# EAGLE schematic C-USG-CPU-10 (EAGLE 9.1.3)
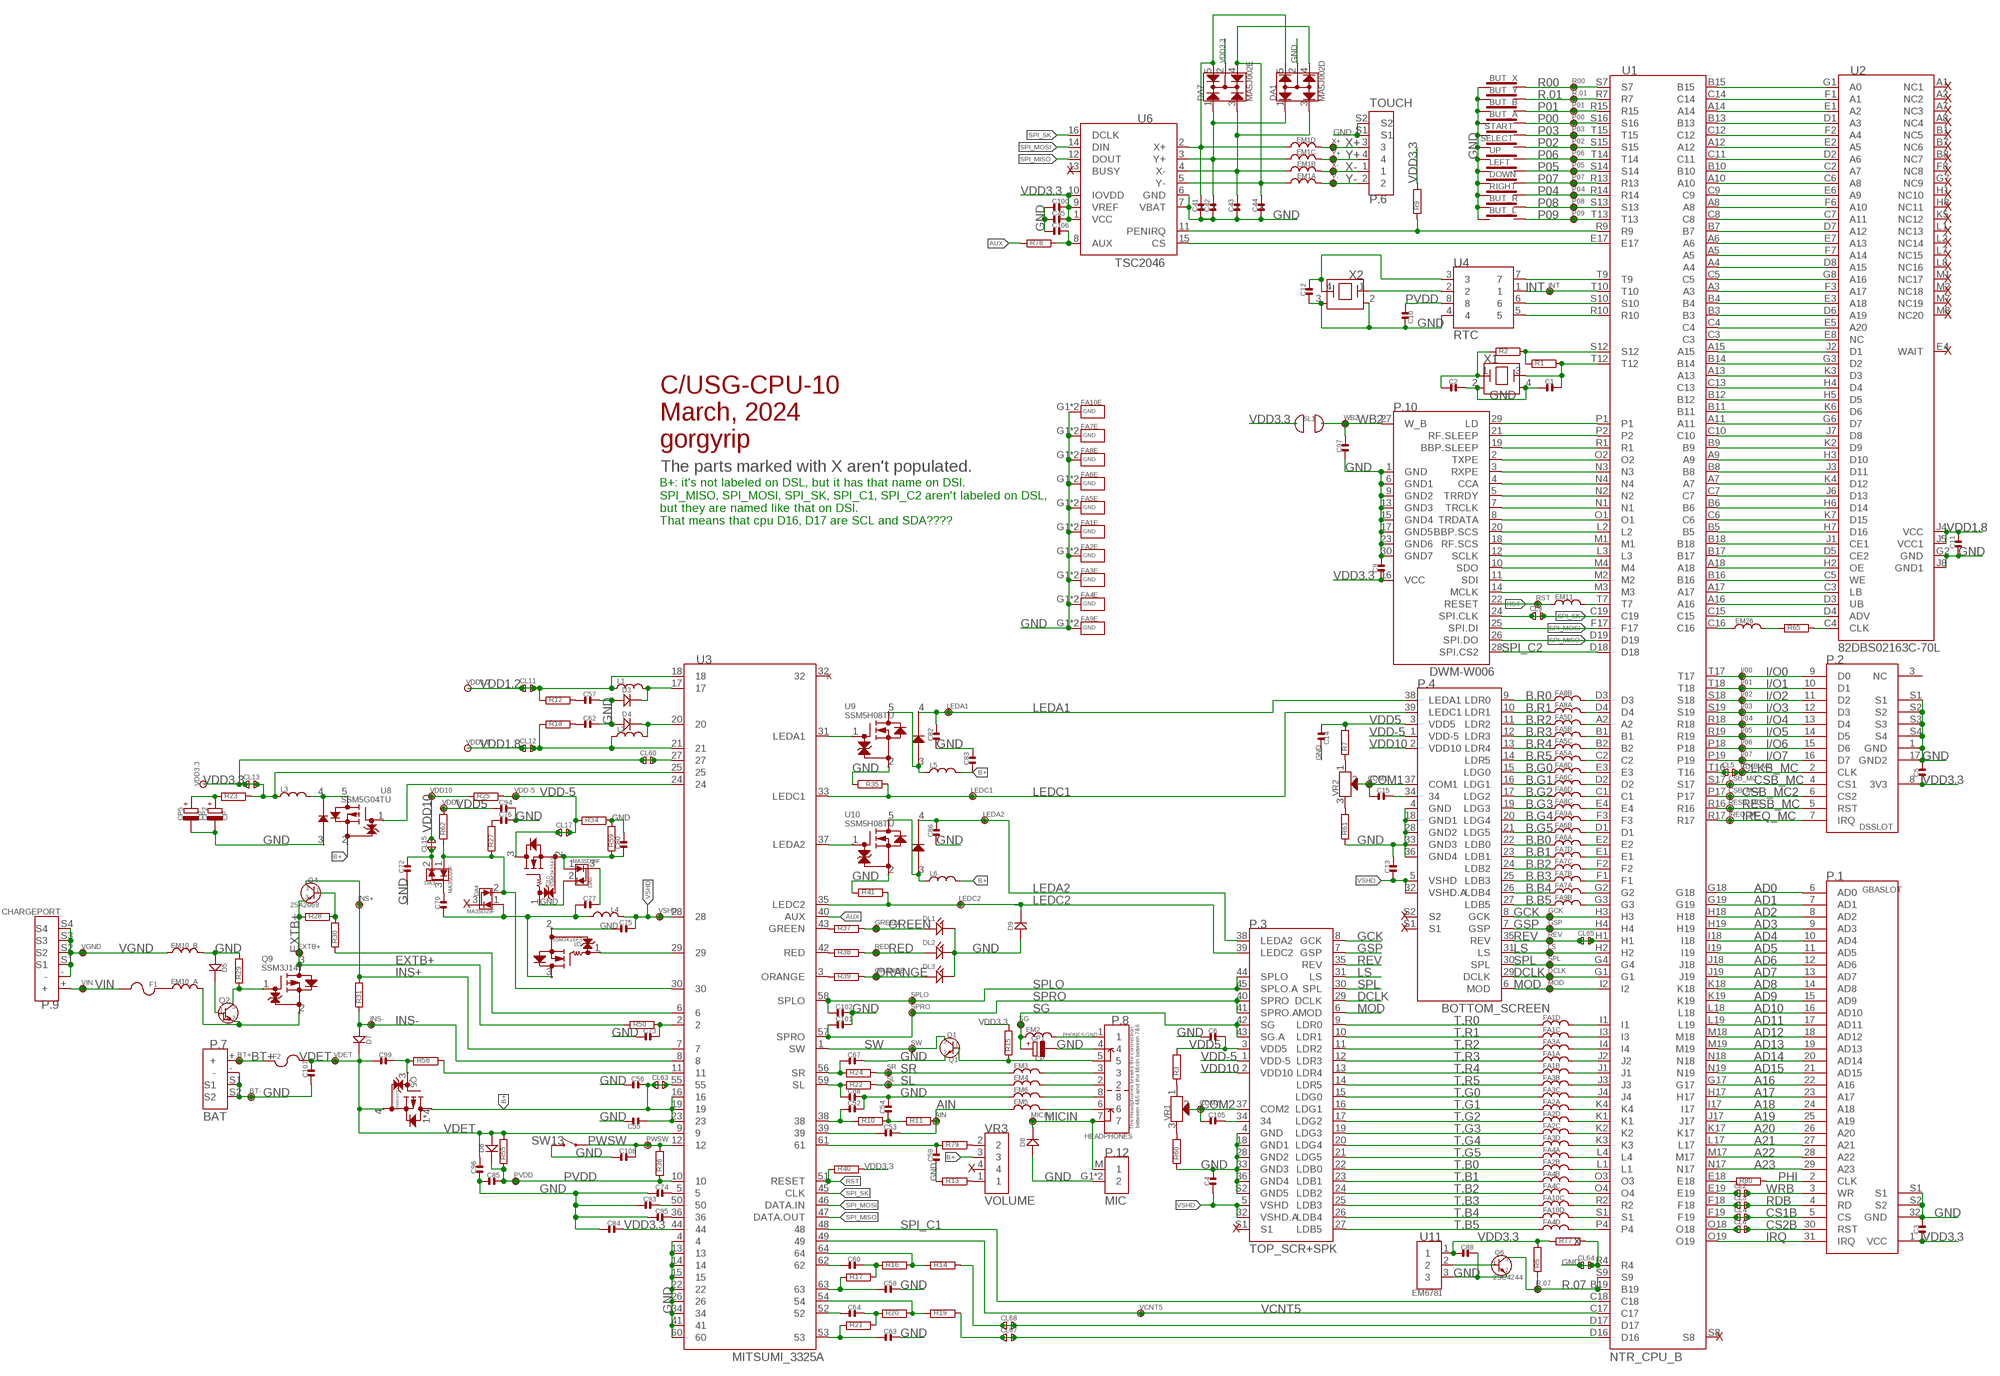
[diagram p0: schematic, sheet 1, part 1 of 2]
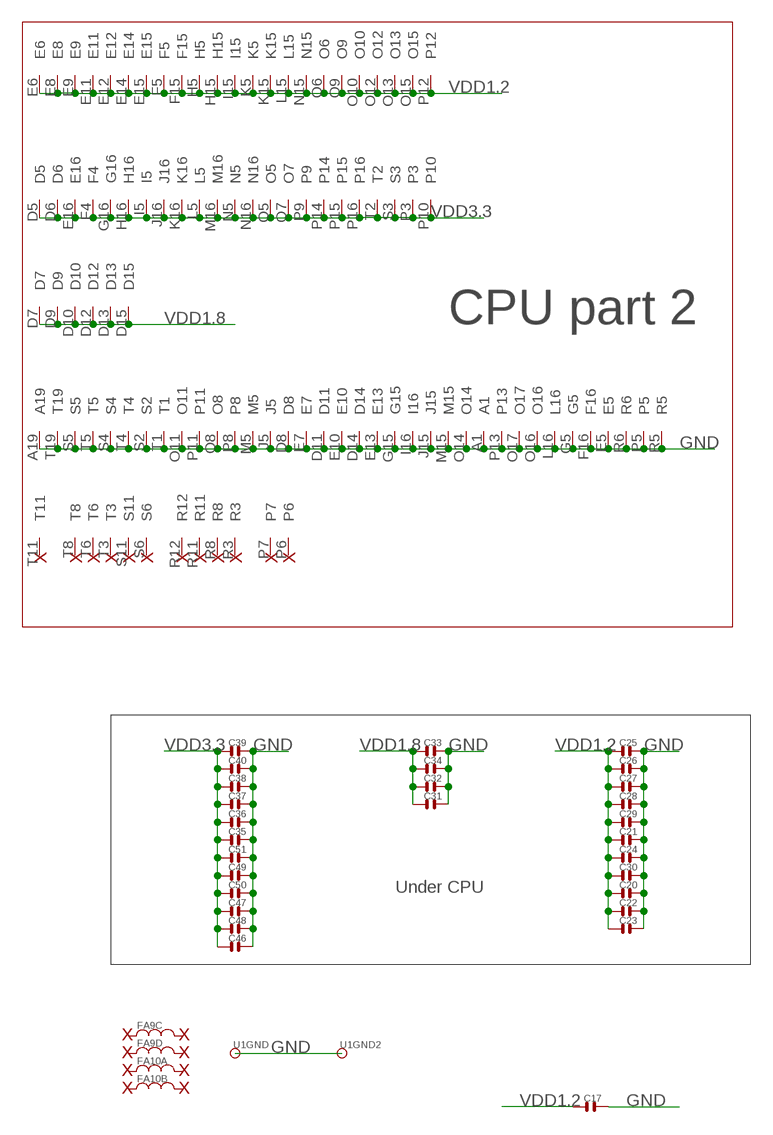
[diagram p1: schematic, sheet 1, part 2 of 2]

## Parts
AIN  TP  [TP]
BT+  TP  [TP]
BT-  TP  [TP]
BUT_A  BUT_ABXY  [BUTTONSABXY]
BUT_B  BUT_ABXY  [BUTTONSABXY]
BUT_L  SHOULDER_BUT  [SHOULDER_BUT]
BUT_R  SHOULDER_BUT  [SHOULDER_BUT]
BUT_X  BUT_ABXY  [BUTTONSABXY]
BUT_Y  BUT_ABXY  [BUTTONSABXY]
C1  C0402  [0402]
C2  C0402  [0402]
C3  C0402  [0402]
C4  C0402  [0402]
C5  C0402  [0402]
C6  C0402  [0402]
C9  C0805  [0805]
C10  C0402  [0402]
C11  C0402  [0402]
C12  C0402  [0402]
C13  C0402  [0402]
C14  C0402  [0402]
C15  C0805  [0805]
C17  C0402  [0402]
C20  C0201  [0201]
C21  C0201  [0201]
C22  C0201  [0201]
C23  C0201  [0201]
C24  C0201  [0201]
C25  C0201  [0201]
C26  C0201  [0201]
C27  C0201  [0201]
C28  C0201  [0201]
C29  C0201  [0201]
C30  C0201  [0201]
C31  C0201  [0201]
C32  C0201  [0201]
C33  C0201  [0201]
C34  C0201  [0201]
C35  C0201  [0201]
C36  C0201  [0201]
C37  C0201  [0201]
C38  C0201  [0201]
C39  C0201  [0201]
C40  C0201  [0201]
C41  C0402  [0402]
C42  C0402  [0402]
C43  C0402  [0402]
C44  C0402  [0402]
C45  C0402  [0402]
C46  C0201  [0201]
C47  C0201  [0201]
C48  C0201  [0201]
C49  C0201  [0201]
C50  C0201  [0201]
C51  C0201  [0201]
C52  C0402  [0402]
C53  C0402  [0402]
C54  C0805  [0805]
C55  C0805  [0805]
C56  C0402  [0402]
C57  C0805  [0805]
C58  C0402  [0402]
C59  C0402  [0402]
C60  C0402  [0402]
C62  C0805  [0805]
C63  C0402  [0402]
C64  C0402  [0402]
C67  C0402  [0402]
C68  C0402  [0402]
C70  C0402  [0402]
C72  C0805  [0805]
C73  C0603  [0603]
C74  C0402  [0402]
C75  C0402  [0402]
C76  C0805  [0805]
C77  C0402  [0402]
C80  C0603  [0603]
C82  C0805  [0805]
C83  C0805  [0805]
C84  C0402  [0402]
C85  C0603  [0603]
C86  C0805  [0805]
C88  C0402  [0402]
C93  C0402  [0402]
C94  C0805  [0805]
C95  C0603  [0603]
C96  C0402  [0402]
C97  C0402  [0402]
C99  C0402  [0402]
C100  C0402  [0402]
C101  C0402  [0402]
C102  C0402  [0402]
C105  C0805  [0805]
C106  C0402  [0402]
C107  C0402  [0402]
C108  C0402  [0402]
CL2  CL  [CL0402]
CL3  CL  [CL0402]
CL4  CL  [CL0402]
CL5  CL  [CL0402]
CL6  CL  [CL0402]
CL9  CL  [CL0402]
CL11  CL  [CL0402]
CL12  CL  [CL0402]
CL13  CL  [CL0402]
CL15  CL  [CL0402]
CL17  CL  [CL0402]
CL60  CL  [CL0402]
CL63  CL  [CL0402]
CL64  CL  [CL0402]
CL65  CL  [CL0402]
CL67  CL  [CL0402]
CL68  CL  [CL0402]
CLKB_MC  TP  [TP]
COM1  TP  [TP]
COM2  TP  [TP]
CP1  CP  [CP]
CP2  CP  [CP]
CP5  CP  [CP]
CSB_MC  TP  [TP]
CSB_MC2  TP  [TP]
D3  D3.4  [D3.4]
D4  D3.4  [D3.4]
D5  D5  [D5]
D6  D6  [D6]
D7  D7  [D7]
D8  D8  [D8]
D9  D5  [D5]
DA1  MA5J002D  [DA]
DA3  MA3SD29F  [MA3SD29F]
DA4  MA3SD29F  [MA3SD29F]
DA5  MA3SD29F  [MA3SD29F]
DA7  MA5J002E  [DA]
DCLK  TP  [TP]
DL1  DL  [DL]
DL2  DL  [DL]
DL3  DL  [DL]
DOWN  DPAD  [DPAD]
EM1  FILTER_NETWORK  [FILTER_NETWORK]
EM2  FILTER0603  [0603]
EM3  FILTER0603  [0603]
EM4  FILTER0603  [0603]
EM5  FILTER0603  [0603]
EM6  FILTER0603  [0603]
EM10  EM10  [EM10]
EM11  FILTER  [0402]
EM26  FILTER  [0402]
EXTB+  TP  [TP]
F1  FUSE  [FUSE]
F2  FUSE  [FUSE]
FA1  FA  [FA]
FA2  FA  [FA]
FA3  FA  [FA]
FA4  FA  [FA]
FA5  FA  [FA]
FA6  FA  [FA]
FA7  FA  [FA]
FA8  FA  [FA]
FA9  FA  [FA]
FA10  FA  [FA]
GCK  TP  [TP]
GREEN  TP  [TP]
GSP  TP  [TP]
I/00  TP  [TP]
I/01  TP  [TP]
I/02  TP  [TP]
I/03  TP  [TP]
I/04  TP  [TP]
I/05  TP  [TP]
I/06  TP  [TP]
I/07  TP  [TP]
INS+  TP  [TP]
INS-  TP  [TP]
INT  TP  [TP]
IREQ_MC  TP  [TP]
L1  INDUCTOR  [INDUCTOR]
L2  INDUCTOR_SMALL  [INDUCTOR_SMALL]
L3  INDUCTOR  [INDUCTOR]
L4  INDUCTOR_SMALL  [INDUCTOR_SMALL]
L5  INDUCTOR  [INDUCTOR]
L6  INDUCTOR  [INDUCTOR]
LEDA1  TP  [TP]
LEDA2  TP  [TP]
LEDC1  TP  [TP]
LEDC2  TP  [TP]
LEFT  DPAD  [DPAD]
LS  TP  [TP]
MICIN  TP  [TP]
MOD  TP  [TP]
ORANGE  TP  [TP]
P00  TP  [TP]
P01  TP  [TP]
P02  TP  [TP]
P03  TP  [TP]
P04  TP  [TP]
P05  TP  [TP]
P06  TP  [TP]
P07  TP  [TP]
P08  TP  [TP]
P09  TP  [TP]
P.1  GBASLOT  [GBA]
P.2  DSSLOT  [DS]
P.3  TOP_SCR+SPK  [TOP_SCR+SPK]
P.4  BOTTOM_SCREEN  [BOTTOM_SCREEN]
P.6  TOUCH  P6  [P6]
P.7  BAT  [BAT]
P.8  HEADPHONES  [HEADPHONES]
P.9  CHARGEPORT  [CHARGEPORT]
P.10  DWM-W006  [DWM--W006]
P.12  MIC  [MIC]
PVDD  TP  [TP]
PWSW  TP  [TP]
Q1  Q1  [Q1]
Q2  DTA143ZM  [SOT723]
Q3  SSM3K16FS  Q3.10  [Q3.10]
Q4  2SA2069  [SOT89-3]
Q5  SSM6J21TU  [UF6]
Q6  2SC4244  Q6  [SOT723]
Q9  SSM3J14T  [TO236]
Q10  SSM3K16FS  Q3.10  [Q3.10]
R00  TP  [TP]
R1  R0402  [0402]
R2  R0402  [0402]
R3  R0402  [0402]
R5  R0402  [0402]
R7  R0402  [0402]
R9  R0402  [0402]
R10  R0402  [0402]
R11  R0402  [0402]
R12  R0402  [0402]
R13  R0402  [0402]
R14  R0402  [0402]
R15  R0402  [0402]
R16  R0402  [0402]
R17  R0402  [0402]
R18  R0402  [0402]
R19  R0402  [0402]
R20  R0402  [0402]
R21  R0402  [0402]
R22  R0402  [0402]
R23  R0402  [0402]
R24  R0402  [0402]
R25  R0402  [0402]
R27  R0402  [0402]
R28  R0402  [0402]
R29  R0402  [0402]
R30  R0402  [0402]
R31  R0805  [0805]
R34  R0402  [0402]
R35  R0402  [0402]
R36  R0402  [0402]
R37  R0402  [0402]
R38  R0402  [0402]
R39  R0402  [0402]
R40  R0402  [0402]
R41  R0402  [0402]
R50  R0402  [0402]
R55  R0402  [0402]
R56  R0402  [0402]
R59  R0402  [0402]
R60  R0402  [0402]
R61  R0402  [0402]
R62  R0402  [0402]
R65  R0402  [0402]
R77  R0402  [0402]
R78  R0402  [0402]
R79  R0402  [0402]
R80  R0402  [0402]
R.01  TP  [TP]
R.07  TP  [TP]
RED  TP  [TP]
RESB_MC  TP  [TP]
REV  TP  [TP]
RIGHT  DPAD  [DPAD]
RST  TP  [TP]
SELECT  BUTTON_SMALL  [BUTTON_SMALL]
SG  TP  [TP]
SL  TP  [TP]
SL1  SL1  [SL1]
SPL  TP  [TP]
SPLO  TP  [TP]
SPRO  TP  [TP]
SR  TP  [TP]
START  BUTTON_SMALL  [BUTTON_SMALL]
SW  TP  [TP]
SW13  SWITCH  [SWITCH]
U1  NTR_CPU_B  [CPU]
U1GND  TP  [TP]
U1GND2  TP  [TP]
U2  82DBS02163C-70L  [RAM]
U3  MITSUMI_3325A  [MITSUMI_3325A]
U4  RTC  U4_RTC  [TSSOP8]
U6  TSC2046  [TSSOP16]
U8  SSM5G04TU  [SOT-353F___(UFV)-M]
U9  SSM5H08TU  [SOT-353F___(UFV)-M]
U10  SSM5H08TU  [SOT-353F___(UFV)-M]
U11  EM6781  [EM6781]
UP  DPAD  [DPAD]
VCNT5  TP  [TP]
VDD1.2  TP  [TP]
VDD1.8  TP  [TP]
VDD3.3  TP  [TP]
VDD5  TP  [TP]
VDD10  TP  [TP]
VDD-5  TP  [TP]
VDET  TP  [TP]
VGND  TP  [TP]
VIN  TP  [TP]
VR1  VR  [VR]
VR2  VR  [VR]
VR3  VOLUME  [VOLUME]
VSHD  TP  [TP]
WB2  TP  [TP]
X1  X1  [X1]
X2  X2  [X2]
X+  TP  [TP]
X-  TP  [TP]
Y+  TP  [TP]
Y-  TP  [TP]

## Nets
A16: P.1.22(A16) U1.G17
A17: P.1.23(A17) U1.H17
A18: P.1.24(A18) U1.I17
A19: P.1.25(A19) U1.J17
A20: P.1.26(A20) U1.K17
A21: P.1.27(A21) U1.L17
A22: P.1.28(A22) U1.M17
A23: P.1.29(A23) U1.N17
AD0: P.1.6(AD0) U1.G18
AD1: P.1.7(AD1) U1.G19
AD2: P.1.8(AD2) U1.H18
AD3: P.1.9(AD3) U1.H19
AD4: P.1.10(AD4) U1.I18
AD5: P.1.11(AD5) U1.I19
AD6: P.1.12(AD6) U1.J18
AD7: P.1.13(AD7) U1.J19
AD8: P.1.14(AD8) U1.K18
AD9: P.1.15(AD9) U1.K19
AD10: P.1.16(AD10) U1.L18
AD11: P.1.17(AD11) U1.L19
AD12: P.1.18(AD12) U1.M18
AD13: P.1.19(AD13) U1.M19
AD14: P.1.20(AD14) U1.N18
AD15: P.1.21(AD15) U1.N19
AIN: AIN.P$1 C53.2 EM5.1 R11.2
AUX: R78.1 U3.40(AUX)
B+: C55.1 C56.2 C83.1 CL63.1 CL63.2 L5.P$2 L6.P$2 Q5.1(D) Q5.2(D) Q5.5(D) Q5.6(D) U3.16 U3.19 U3.23 U3.55 U8.2 VR3.3
B.B0: FA6.1 P.4.22(LDB0)
B.B1: FA7.7 P.4.23(LDB1)
B.B2: FA7.5 P.4.24(LDB2)
B.B3: FA7.3 P.4.25(LDB3)
B.B4: FA7.1 P.4.26(LDB4)
B.B5: FA9.3 P.4.27(LDB5)
B.G0: FA8.7 P.4.15(LDG0)
B.G1: FA6.5 P.4.16(LDG1)
B.G2: FA6.7 P.4.17(LDG2)
B.G3: FA8.5 P.4.19(LDG3)
B.G4: FA9.1 P.4.20(LDG4)
B.G5: FA6.3 P.4.21(LDG5)
B.R0: FA8.3 P.4.9(LDR0)
B.R1: FA8.1 P.4.10(LDR1)
B.R2: FA5.7 P.4.11(LDR2)
B.R3: FA5.3 P.4.12(LDR3)
B.R4: FA5.5 P.4.13(LDR4)
B.R5: FA5.1 P.4.14(LDR5)
BT+: BT+.P$1 F2.1 P.7.+
CLKB_MC: CL5.1 CL5.2 CLKB_MC.P$1 P.2.2(CLK) U1.T16
COM1: C15.1 COM1.P$1 P.4.37(COM1) VR2.2
COM2: C105.1 COM2.P$1 P.3.37(COM2) VR1.2
CS1B: CL4.1 CL4.2 P.1.5(CS) U1.F19
CS2B: CL6.1 CL6.2 P.1.30(RST) U1.O18
CSB_MC: CSB_MC.P$1 P.2.4(CS1) U1.S17
CSB_MC2: CSB_MC2.P$1 P.2.6(CS2) U1.P17
DCLK: DCLK.P$1 P.3.29(DCLK) P.4.29(DCLK) U1.G1
EXTB+: EXTB+.P$1 Q4.3 Q9.3 R28.1 R50.1
GCK: GCK.P$1 P.3.8(GCK) P.4.8(GCK) U1.H3
GND: BT-.P$1 BUT_A.1 BUT_A.4 BUT_B.1 BUT_B.4 BUT_L.1 BUT_L.3 BUT_L.S1 BUT_L.S2 BUT_R.1 BUT_R.3 BUT_R.S1 BUT_R.S2 BUT_X.1 BUT_X.4 BUT_Y.1 BUT_Y.4 C1.1 C2.2 C3.2 C4.2 C5.2 C6.1 C9.2 C10.2 C11.1 C12.1 C13.2 C14.2 C17.2 C20.2 C21.2 C22.2 C23.2 C24.2 C25.2 C26.2 C27.2 C28.2 C29.2 C30.2 C31.2 C32.2 C33.2 C34.2 C35.2 C36.2 C37.2 C38.2 C39.2 C40.2 C41.1 C42.1 C43.1 C44.1 C45.1 C46.2 C47.2 C48.2 C49.2 C50.2 C51.2 C52.2 C54.2 C55.2 C56.1 C57.2 C58.2 C59.1 C62.2 C63.2 C67.2 C68.2 C72.1 C73.1 C74.1 C75.1 C76.2 C80.2 C82.1 C83.2 C84.1 C85.1 C86.1 C88.2 C93.1 C94.2 C95.1 C96.1 C97.1 C100.1 C101.2 C102.2 C106.1 C107.1 C108.1 CL64.1 CL64.2 CP1.1 CP2.1 CP5.1 D3.A D4.A D5.A D8.A D9.A DA1.2 DA5.2 DL1.C DL2.C DL3.C DOWN.1 DOWN.4 EM6.1 EM10.3 FA1.G1(E:GND) FA1.G2(E:GND) FA2.G1(E:GND) FA2.G2(E:GND) FA3.G1(E:GND) FA3.G2(E:GND) FA4.G1(E:GND) FA4.G2(E:GND) FA5.G1(E:GND) FA5.G2(E:GND) FA6.G1(E:GND) FA6.G2(E:GND) FA7.G1(E:GND) FA7.G2(E:GND) FA8.G1(E:GND) FA8.G2(E:GND) FA9.G1(E:GND) FA9.G2(E:GND) FA10.G1(E:GND) FA10.G2(E:GND) LEFT.1 LEFT.4 P.1.32(GND) P.1.S1 P.1.S2 P.2.1(GND) P.2.17(GND2) P.2.S1 P.2.S2 P.2.S3 P.2.S4 P.3.4(GND) P.3.18(GND1) P.3.28(GND2) P.3.33(GND3) P.3.36(GND4) P.3.S2(GND5) P.4.4(GND) P.4.18(GND1) P.4.28(GND2) P.4.33(GND3) P.4.36(GND4) P.6.S1 P.6.S2 P.7.- P.7.S1 P.7.S2 P.8.4 P.10.1(GND) P.10.6(GND1) P.10.9(GND2) P.10.13(GND3) P.10.15(GND4) P.10.17(GND5) P.10.23(GND6) P.10.30(GND7) P.12.G1 P.12.G2 Q1.2 Q3.2 Q6.2 Q10.1 R13.1 R29.2 R34.2 R35.2 R41.1 R59.2 R60.1 R61.1 R77.2 RIGHT.1 RIGHT.4 SELECT.2 SELECT.3 START.2 START.3 SW13.2 SW13.S1 SW13.S2 U1.A1 U1.A19 U1.D8 U1.D11 U1.D14 U1.E5 U1.E7 U1.E10 U1.E13 U1.F16 U1.G5 U1.G15 U1.I16 U1.J5 U1.J15 U1.L16 U1.M5 U1.M15 U1.O8 U1.O11 U1.O14 U1.O16 U1.O17 U1.P5 U1.P8 U1.P11 U1.P13 U1.R4 U1.R5 U1.R6 U1.S2 U1.S4 U1.S5 U1.T1 U1.T4 U1.T5 U1.T19 U1GND2.P$1 U1GND.P$1 U2.G2(GND) U2.J8(GND1) U3.4 U3.13 U3.14 U3.15 U3.22 U3.26 U3.34 U3.41 U3.60 U4.4 U6.6(GND) U6.7(VBAT) U8.3 U9.2 U10.2 U11.3 UP.1 UP.4 X1.2 X1.4 X2.2 X2.3
GREEN: DL1.A GREEN.P$1 R37.2
GSP: GSP.P$1 P.3.7(GSP) P.4.7(GSP) U1.H4
I/O0: I/00.P$1 P.2.9(D0) U1.T17
I/O1: I/01.P$1 P.2.10(D1) U1.T18
I/O2: I/02.P$1 P.2.11(D2) U1.S18
I/O3: I/03.P$1 P.2.12(D3) U1.S19
I/O4: I/04.P$1 P.2.13(D4) U1.R18
I/O5: I/05.P$1 P.2.14(D5) U1.R19
I/O6: I/06.P$1 P.2.15(D6) U1.P18
I/O7: I/07.P$1 P.2.16(D7) U1.P19
INS+: INS+.P$1 Q4.2 Q4.P R31.2 U3.7
INS-: D7.A INS-.P$1 R31.1 U3.8
INT: INT.P$1 U1.T10 U4.1
IREQ_MC: IREQ_MC.P$1 P.2.7(IRQ) U1.R17
IRQ: P.1.31(IRQ) U1.O19
LEDA1: C82.2 LEDA1.P$1 P.4.38(LEDA1) U9.4
LEDA2: C86.2 LEDA2.P$1 P.3.38(LEDA2) U10.4
LEDC1: LEDC1.P$1 P.4.39(LEDC1) R35.1 U3.33(LEDC1)
LEDC2: D9.C LEDC2.P$1 P.3.39(LEDC2) R41.2 U3.35(LEDC2)
LS: LS.P$1 P.3.31(LS) P.4.31(LS) U1.H2
MICIN: D8.C MICIN.P$1 P.8.7 P.12.M
MOD: MOD.P$1 P.3.6(MOD) P.4.6(MOD) U1.I2
N$1: P.8.5 Q1.1 R15.1
N$3: C95.2 U3.36
N$4: C99.2 Q5.3(G) R56.1
N$5: C70.2 DA3.3
N$6: Q6.1 U11.2
N$7: U1.B15 U2.G1(A0)
N$8: C74.2 U3.5
N$9: U1.C14 U2.F1(A1)
N$10: C77.2 DA5.3
N$11: C62.1 R18.2
N$12: U1.A14 U2.E1(A2)
N$13: EM3.2 P.8.3
N$14: EM4.2 P.8.2
N$15: R9.1 U1.R9 U6.11(PENIRQ)
N$16: C67.1 R24.1 U3.56(SR)
N$17: C68.1 R22.1 U3.59(SL)
N$18: U1.B13 U2.D1(A3)
N$19: R37.1 U3.43(GREEN)
N$21: U1.C12 U2.F2(A4)
N$22: U1.A12 U2.E2(A5)
N$23: U1.C11 U2.D2(A6)
N$24: U1.B10 U2.C2(A7)
N$25: R56.2 U3.11
N$26: U1.A10 U2.C6(A8)
N$27: C58.1 R17.1 U3.63
N$28: U1.C9 U2.E6(A9)
N$30: C64.1 U3.52
N$31: U1.A8 U2.F6(A10)
N$32: FA8.4 U1.D3
N$33: U1.E17 U6.15(CS)
N$34: C93.2 U3.50
N$35: U1.T9 U4.7
N$36: C42.2 DA1.1 DA7.1 EM1.6 U6.3(Y+)
N$37: U1.C8 U2.C7(A11)
N$38: U1.B7 U2.D7(A12)
N$39: R80.1 U1.E18
N$40: U4.2 X2.1
N$41: C106.2 R78.2 U6.8(AUX)
N$42: C43.2 DA1.3 DA7.3 EM1.4 U6.4(X-)
N$43: C44.2 DA1.4 DA7.4 EM1.2 U6.5(Y-)
N$44: U1.S10 U4.6
N$45: C41.2 DA1.5 DA7.5 EM1.8 U6.2(X+)
N$46: U1.R10 U4.5
N$47: C12.2 U4.3 X2.4
N$48: R1.1 R2.2 U1.S12
N$49: C1.2 R1.2 U1.T12 X1.3
N$50: P.10.29(LD) U1.P1
N$51: C2.1 R2.1 X1.1
N$52: P.10.21(RF.SLEEP) U1.P2
N$54: P.10.19(BBP.SLEEP) U1.R1
N$55: P.10.2(TXPE) U1.O2
N$56: P.10.3(RXPE) U1.N3
N$57: P.10.4(CCA) U1.N4
N$58: P.10.5(TRRDY) U1.N2
N$59: P.10.7(TRCLK) U1.N1
N$60: U1.A6 U2.E7(A13)
N$61: P.10.8(TRDATA) U1.O1
N$62: U1.A5 U2.F7(A14)
N$63: P.10.20(BBP.SCS) U1.L2
N$64: U1.A4 U2.D8(A15)
N$65: U1.C5 U2.G8(A16)
N$66: U1.A3 U2.F3(A17)
N$68: U1.B4 U2.E3(A18)
N$69: U1.B3 U2.D6(A19)
N$70: C63.1 R21.1 U3.53
N$71: U1.C4 U2.E5(A20)
N$72: U1.C3 U2.E8(NC)
N$73: U1.A15 U2.J2(D1)
N$74: EM10.2 F1.1
N$75: Q2.3 Q9.1 R29.1
N$76: C52.1 R10.1 U3.38
N$77: U1.B14 U2.G3(D2)
N$78: U1.A13 U2.K3(D3)
N$79: P.10.10(SDO) U1.M4
N$80: C70.1 C77.1 DA4.1 L4.2 Q3.3
N$81: FA8.2 U1.D4
N$82: P.10.11(SDI) U1.M2
N$83: P.10.18(RF.SCS) U1.M1
N$84: U1.C13 U2.H4(D4)
N$85: P.10.12(SCLK) U1.L3
N$86: C73.2 R50.2 U3.2
N$87: P.10.14(MCLK) U1.M3
N$88: EM11.2 U1.T7
N$89: FA5.8 U1.A2
N$90: U1.B12 U2.H5(D5)
N$91: FA5.4 U1.B1
N$92: FA5.6 U1.B2
N$93: FA5.2 U1.C2
N$94: U1.B11 U2.K6(D6)
N$95: FA8.8 U1.E3
N$96: FA6.6 U1.D2
N$97: U1.A11 U2.G6(D7)
N$98: FA6.8 U1.C1
N$99: FA8.6 U1.E4
N$100: FA9.2 U1.F3
N$101: R39.1 U3.3(ORANGE)
N$102: U1.C10 U2.J7(D8)
N$103: FA6.4 U1.D1
N$104: C54.1 R10.2 R11.1
N$105: U1.B9 U2.K2(D9)
N$106: Q3.1 U3.29
N$107: C53.1 U3.39
N$108: U1.A9 U2.H3(D10)
N$109: U1.B8 U2.J3(D11)
N$110: U1.A7 U2.K4(D12)
N$111: C64.2 R20.1 R21.2
N$112: U1.C7 U2.J6(D13)
N$113: FA6.2 U1.E2
N$114: FA7.8 U1.E1
N$115: FA7.6 U1.F2
N$116: FA7.4 U1.F1
N$117: FA7.2 U1.G2
N$118: FA9.4 U1.G3
N$119: FA1.8 U1.I1
N$120: FA1.6 U1.I3
N$121: FA3.2 U1.I4
N$122: R13.2 VR3.1
N$123: U1.B6 U2.H6(D14)
N$124: U1.C6 U2.K7(D15)
N$125: D5.C Q2.1
N$126: EM10.1 Q2.2 Q9.2
N$127: Q4.1 R28.2 R30.2
N$128: U1.B5 U2.H7(D16)
N$129: FA1.2 U1.J2
N$130: U1.B18 U2.J1(CE1)
N$131: C59.2 R79.1 U3.61
N$132: FA1.4 U1.J1
N$133: U1.B17 U2.D5(CE2)
N$134: U1.A18 U2.H2(OE)
N$135: U1.B16 U2.C5(WE)
N$136: U1.A17 U2.C3(LB)
N$137: U1.A16 U2.D3(UB)
N$138: FA3.4 U1.J3
N$139: FA3.6 U1.J4
N$140: FA2.2 U1.K4
N$141: FA2.8 U1.K1
N$142: FA2.6 U1.K2
N$143: U1.C15 U2.D4(ADV)
N$144: EM26.1 U1.C16
N$145: EM26.2 R65.1
N$146: R65.2 U2.C4(CLK)
N$147: FA3.8 U1.K3
N$148: FA4.2 U1.L4
N$149: FA2.4 U1.L1
N$150: R7.1 VR2.1
N$151: FA4.4 U1.O3
N$152: FA4.6 U1.O4
N$153: FA10.6 U1.R2
N$154: FA10.8 U1.S1
N$155: FA4.8 U1.P4
N$156: C15.2 P.4.34
N$157: R61.2 VR2.3
N$158: R3.1 VR1.1
N$159: C105.2 P.3.34
N$160: R60.2 VR1.3
N$161: R19.1 R20.2 U3.54
N$162: CL67.1 CL67.2 R19.2 U1.D16
N$163: C60.2 R16.1 R17.2
N$164: C60.1 U3.62
N$165: R14.1 R16.2 U3.64
N$166: CL68.1 CL68.2 R14.2 U1.D17
N$167: R79.2 VR3.2
N$168: U3.31(LEDA1) U9.1
N$169: U3.37(LEDA2) U10.1
N$170: L5.P$1 U9.3 U9.5
N$171: R38.1 U3.42(RED)
N$172: L6.P$1 U10.3 U10.5
N$173: EM6.2 P.8.8
N$174: EM5.2 P.8.6
N$175: R30.1 U3.6
N$176: C80.1 DA5.1 Q10.2 R59.1
N$177: DA3.1 DA4.2 R27.1 R62.1 U3.30
N$178: C76.1 R27.2
N$179: L3.P$2 U8.4 U8.5
N$180: CP2.2 CP5.2 R23.1
N$181: U3.24 U8.1
N$182: D4.C L2.2 U3.20
N$183: C57.1 R12.2
N$185: D3.C L1.P$2 U3.17
ORANGE: DL3.A ORANGE.P$1 R39.2
P00: BUT_A.2 BUT_A.3 P00.P$1 U1.S16
P01: BUT_B.2 BUT_B.3 P01.P$1 U1.R15
P02: P02.P$1 SELECT.1 SELECT.4 U1.S15
P03: P03.P$1 START.1 START.4 U1.T15
P04: P04.P$1 RIGHT.2 RIGHT.3 U1.R14
P05: LEFT.2 LEFT.3 P05.P$1 U1.S14
P06: P06.P$1 U1.T14 UP.2 UP.3
P07: DOWN.2 DOWN.3 P07.P$1 U1.R13
P08: BUT_R.2 P08.P$1 U1.S13
P09: BUT_L.2 P09.P$1 U1.T13
PHI: P.1.2(CLK) R80.2
PHONES.GND: EM2.2 P.8.1
PVDD: C10.1 C85.2 D6.C PVDD.P$1 R36.1 R55.1 U3.10 U4.8
PWSW: C108.2 PWSW.P$1 R36.2 SW13.1 U3.12
R00: BUT_X.2 BUT_X.3 R00.P$1 U1.S7
R.01: BUT_Y.2 BUT_Y.3 R.01.P$1 U1.R7
R.07: Q6.3 R5.1 R.07.P$1 U1.B19 U1.S9
RDB: CL3.1 CL3.2 P.1.4(RD) U1.F18
RED: DL2.A R38.2 RED.P$1
RESB_MC: P.2.5(RST) RESB_MC.P$1 U1.R16
REV: CL65.1 CL65.2 P.3.35(REV) P.4.35(REV) REV.P$1 U1.H1
RST: EM11.1 P.10.22(RESET) R40.1 RST.P$1 U3.51(RESET)
SG: CP1.2 EM2.1 P.3.42(SG) P.3.43(SG.A) SG.P$1
SL: EM4.1 R22.2 SL.P$1
SPI_C1: U1.C18 U3.48
SPI_C2: P.10.28(SPI.CS2) U1.D18
SPI_MISO: P.10.26(SPI.DO) U1.D19 U3.47(DATA.OUT) U6.12(DOUT)
SPI_MOSI: P.10.25(SPI.DI) U1.F17 U3.46(DATA.IN) U6.14(DIN)
SPI_SK: CL9.1 CL9.2 P.10.24(SPI.CLK) U1.C19 U3.45(CLK) U6.16(DCLK)
SPL: P.3.30(SPL) P.4.30(SPL) SPL.P$1 U1.G4
SPLO: C102.1 P.3.44(SPLO) P.3.45(SPLO.A) SPLO.P$1 U3.58(SPLO)
SPRO: C101.1 P.3.40(SPRO) P.3.41(SPRO.A) SPRO.P$1 U3.57(SPRO)
SR: EM3.1 R24.2 SR.P$1
SW: Q1.3 SW.P$1 U3.1(SW)
T.B0: FA2.3 P.3.22(LDB0)
T.B1: FA4.3 P.3.23(LDB1)
T.B2: FA4.5 P.3.24(LDB2)
T.B3: FA10.5 P.3.25(LDB3)
T.B4: FA10.7 P.3.26(LDB4)
T.B5: FA4.7 P.3.27(LDB5)
T.G0: FA3.5 P.3.15(LDG0)
T.G1: FA2.1 P.3.16(LDG1)
T.G2: FA2.7 P.3.17(LDG2)
T.G3: FA2.5 P.3.19(LDG3)
T.G4: FA3.7 P.3.20(LDG4)
T.G5: FA4.1 P.3.21(LDG5)
T.R0: FA1.7 P.3.9(LDR0)
T.R1: FA1.5 P.3.10(LDR1)
T.R2: FA3.1 P.3.11(LDR2)
T.R3: FA1.1 P.3.12(LDR3)
T.R4: FA1.3 P.3.13(LDR4)
T.R5: FA3.3 P.3.14(LDR5)
VCNT5: U1.C17 U3.49 VCNT5.P$1
VDD1.2: C17.1 C20.1 C21.1 C22.1 C23.1 C24.1 C25.1 C26.1 C27.1 C28.1 C29.1 C30.1 CL11.1 CL11.2 L1.P$1 R12.1 U1.E6 U1.E8 U1.E9 U1.E11 U1.E12 U1.E14 U1.E15 U1.F5 U1.F15 U1.H5 U1.H15 U1.I15 U1.K5 U1.K15 U1.L15 U1.N15 U1.O6 U1.O9 U1.O10 U1.O12 U1.O13 U1.O15 U1.P12 U3.18 VDD1.2.P$1
VDD1.8: C11.2 C31.1 C32.1 C33.1 C34.1 CL12.1 CL12.2 L2.1 R18.1 U1.D7 U1.D9 U1.D10 U1.D12 U1.D13 U1.D15 U2.J4(VCC) U2.J5(VCC1) U3.21 VDD1.8.P$1
VDD3.3: C3.1 C5.1 C9.1 C35.1 C36.1 C37.1 C38.1 C39.1 C40.1 C45.2 C46.1 C47.1 C48.1 C49.1 C50.1 C51.1 C84.2 C88.1 C100.2 CL13.1 CL13.2 CL60.1 CL60.2 DA7.2 L3.P$1 P.1.1(VCC) P.2.8(3V3) P.10.16(VCC) R5.2 R9.2 R15.2 R23.2 R40.2 R77.1 SL1.P$2 U1.D5 U1.D6 U1.E16 U1.F4 U1.G16 U1.H16 U1.I5 U1.J16 U1.K16 U1.L5 U1.M16 U1.N5 U1.N16 U1.O5 U1.O7 U1.P3 U1.P9 U1.P10 U1.P14 U1.P15 U1.P16 U1.S3 U1.T2 U3.25 U3.27 U3.44 U6.1(VCC) U6.9(VREF) U6.10(IOVDD) U11.1 VDD3.3.P$1
VDD5: C6.2 C14.1 C94.1 P.3.3(VDD5) P.4.3(VDD5) R3.2 R7.2 R62.2 VDD5.P$1
VDD10: C72.2 CL15.1 CL15.2 DA3.2 P.3.2(VDD10) P.4.2(VDD10) R25.1 VDD10.P$1
VDD-5: CL17.1 CL17.2 P.3.1(VDD-5) P.4.1(VDD-5) Q10.3 R25.2 R34.1 VDD-5.P$1
VDET: C96.2 C99.1 C107.2 D6.A D7.C F2.2 Q5.4(S) R55.2 U3.9 VDET.P$1
VGND: EM10.4 P.9.- P.9.S1 P.9.S2 P.9.S3 P.9.S4 VGND.P$1
VIN: F1.2 P.9.+ VIN.P$1
VSHD: C4.1 C13.1 C75.2 L4.1 P.3.5(VSHD) P.3.32(VSHD.A) P.4.5(VSHD) P.4.32(VSHD.A) U3.28 VSHD.P$1
WB2: C97.2 P.10.27(W_B) SL1.P$1 WB2.P$1
WRB: CL2.1 CL2.2 P.1.3(WR) U1.E19
X+: EM1.7 P.6.3 X+.P$1
X-: EM1.3 P.6.1 X-.P$1
Y+: EM1.5 P.6.4 Y+.P$1
Y-: EM1.1 P.6.2 Y-.P$1
Unconnected: DA4.3 FA9.5 FA9.6 FA9.7 FA9.8 FA10.1 FA10.2 FA10.3 FA10.4 P.2.3(NC) P.3.S1 P.4.S1 P.4.S2 U1.P6 U1.P7 U1.R3 U1.R8 U1.R11 U1.R12 U1.S6 U1.S8 U1.S11 U1.T3 U1.T6 U1.T8 U1.T11 U2.A1(NC1) U2.A2(NC2) U2.A7(NC3) U2.A8(NC4) U2.B1(NC5) U2.B7(NC6) U2.B8(NC7) U2.E4(WAIT) U2.F8(NC8) U2.G7(NC9) U2.H1(NC10) U2.H8(NC11) U2.K5(NC12) U2.L1(NC13) U2.L2(NC14) U2.L7(NC15) U2.L8(NC16) U2.M1(NC17) U2.M2(NC18) U2.M7(NC19) U2.M8(NC20) U3.32 U6.13(BUSY) VR3.4

## Notes on the sheet
- X
- X
- X
- X
- X
- X
- X
- X | X
- X
- X
- X | X | X | X | X
- X
- X
- X
- X
- X
- X
- X
- X
- X
- X
- X | X | X | X | X | X | X | X | X | X | X | X
- C/USG-CPU-10
  March, 2024
  gorgyrip
- The parts marked with X aren't populated.
- B+: it's not labeled on DSL, but it has that name on DSI.
  SPI_MISO, SPI_MOSI, SPI_SK, SPI_C1, SPI_C2 aren't labeled on DSL,
  but they are named like that on DSI.
  That means that cpu D16, D17 are SCL and SDA????
- Under CPU
- X
- X | X
- X | X
- X | X
- X | X
- X
- X
- X
- X
- X
- X
- X

## Library data of the parts
AIN BT+ BT- CLKB_MC COM1 COM2 CSB_MC CSB_MC2 DCLK EXTB+ GCK GREEN GSP I/00 I/01-I/07 INS+ INS- INT IREQ_MC LEDA1 LEDA2 LEDC1 LEDC2 LS MICIN MOD ORANGE P00 P01-P09 PVDD PWSW R00 R.01 R.07 RED RESB_MC REV RST SG SL SPL SPLO SPRO SR SW U1GND U1GND2 VCNT5 VDD1.2 VDD1.8 VDD3.3 VDD5 VDD10 VDD-5 VDET VGND VIN VSHD WB2 X+ X- Y+ Y- = dslparts:TP
BUT_A BUT_B BUT_X BUT_Y = dslparts:BUT_ABXY
BUT_L BUT_R = dslparts:SHOULDER_BUT
C1-C6 C10-C14 C17 C41-C45 C52 C53 C56 C58-C60 C63 C64 C67 C68 C70 C74 C75 C77 C84 C88 C93 C96 C97 C99-C102 C106-C108 = dslparts:C0402
C9 C15 C54 C55 C57 C62 C72 C76 C82 C83 C86 C94 C105 = dslparts:C0805
C20-C40 C46-C51 = dslparts:C0201
C73 C80 C85 C95 = dslparts:C0603
CL2-CL6 CL9 CL11-CL13 CL15 CL17 CL60 CL63-CL65 CL67 CL68 = dslparts:CL
CP1 CP2 CP5 = dslparts:CP
D3 D4 = dslparts:D3.4
D5 D9 = dslparts:D5
D6 = dslparts:D6
D7 = dslparts:D7
D8 = dslparts:D8
DA1 = dslparts:MA5J002D
DA3-DA5 = dslparts:MA3SD29F
DA7 = dslparts:MA5J002E
DL1-DL3 = dslparts:DL
DOWN LEFT RIGHT UP = dslparts:DPAD
EM1 = dslparts:FILTER_NETWORK
EM2-EM6 = dslparts:FILTER0603
EM10 = dslparts:EM10
EM11 EM26 = dslparts:FILTER
F1 F2 = dslparts:FUSE
FA1-FA10 = dslparts:FA
L1 L3 L5 L6 = dslparts:INDUCTOR
L2 L4 = dslparts:INDUCTOR_SMALL
P.1 = dslparts:GBASLOT
P.2 = dslparts:DSSLOT
P.3 = dslparts:TOP_SCR+SPK
P.4 = dslparts:BOTTOM_SCREEN
P.6 = dslparts:P6
P.7 = dslparts:BAT
P.8 = dslparts:HEADPHONES
P.9 = dslparts:CHARGEPORT
P.10 = dslparts:DWM-W006
P.12 = dslparts:MIC
Q1 = dslparts:Q1
Q2 = dslparts:DTA143ZM
Q3 Q10 = dslparts:Q3.10
Q4 = dslparts:2SA2069
Q5 = dslparts:SSM6J21TU
Q6 = dslparts:Q6
Q9 = dslparts:SSM3J14T
R1-R3 R5 R7 R9-R25 R27-R30 R34-R41 R50 R55 R56 R59-R62 R65 R77-R80 = dslparts:R0402
R31 = dslparts:R0805
SELECT START = dslparts:BUTTON_SMALL
SL1 = dslparts:SL1
SW13 = dslparts:SWITCH
U1 = dslparts:NTR_CPU_B
U2 = dslparts:82DBS02163C-70L
U3 = dslparts:MITSUMI_3325A
U4 = dslparts:U4_RTC
U6 = dslparts:TSC2046
U8 = dslparts:SSM5G04TU
U9 U10 = dslparts:SSM5H08TU
U11 = dslparts:EM6781
VR1 VR2 = dslparts:VR
VR3 = dslparts:VOLUME
X1 = dslparts:X1
X2 = dslparts:X2